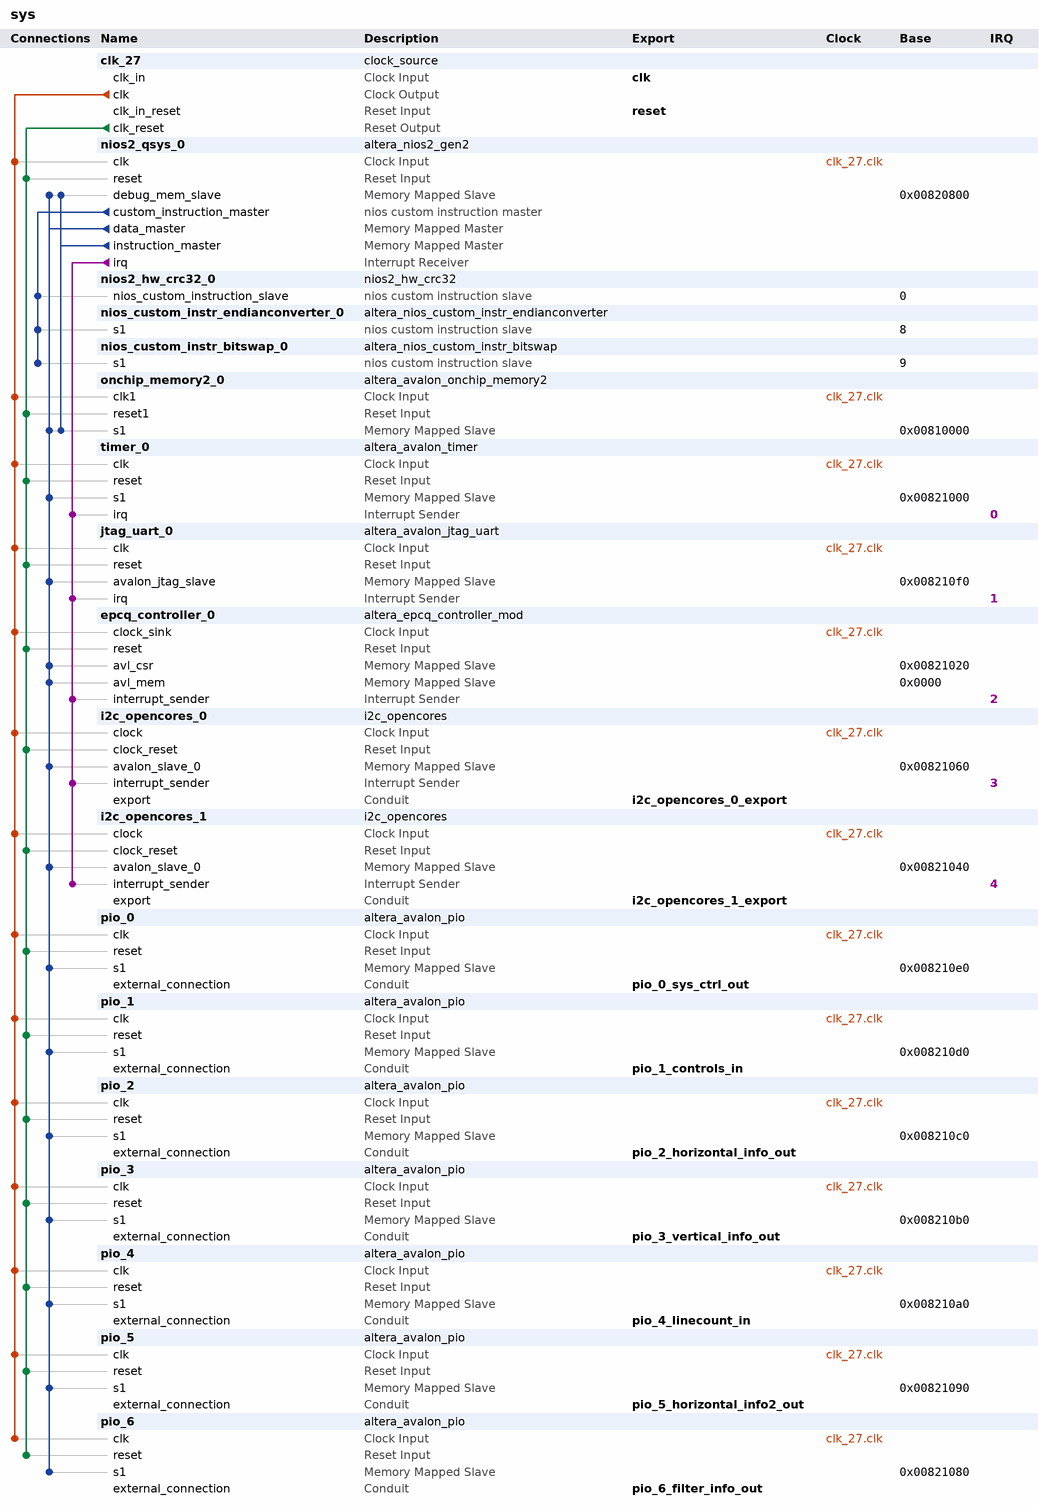
[diagram p0: system contents]
# Platform Designer (Qsys) system sys, Cyclone IV E EP4CE15E22C8
# Parameters at their usual value, and those the tool derives, are not listed.
package require -exact qsys 16.1
create_system sys
set_project_property DEVICE_FAMILY {Cyclone IV E}
set_project_property DEVICE EP4CE15E22C8

add_instance clk_27 clock_source 16.1
set_instance_parameter_value clk_27 clockFrequency 27000000

add_instance nios2_qsys_0 altera_nios2_gen2 16.1
set_instance_parameter_value nios2_qsys_0 dcache_size 0
set_instance_parameter_value nios2_qsys_0 exceptionSlave onchip_memory2_0.s1
set_instance_parameter_value nios2_qsys_0 icache_size 0
set_instance_parameter_value nios2_qsys_0 impl Tiny
set_instance_parameter_value nios2_qsys_0 resetSlave onchip_memory2_0.s1
set_instance_parameter_value nios2_qsys_0 setting_activateTrace true

add_instance nios2_hw_crc32_0 nios2_hw_crc32 16.1
set_instance_parameter_value nios2_hw_crc32_0 crc_width 32
set_instance_parameter_value nios2_hw_crc32_0 polynomial 79764919
set_instance_parameter_value nios2_hw_crc32_0 polynomial_inital 4294967295
set_instance_parameter_value nios2_hw_crc32_0 reflected_input 1
set_instance_parameter_value nios2_hw_crc32_0 reflected_output 1
set_instance_parameter_value nios2_hw_crc32_0 xor_output 4294967295

add_instance nios_custom_instr_endianconverter_0 altera_nios_custom_instr_endianconverter 16.1

add_instance nios_custom_instr_bitswap_0 altera_nios_custom_instr_bitswap 16.1

add_instance onchip_memory2_0 altera_avalon_onchip_memory2 16.1
set_instance_parameter_value onchip_memory2_0 dataWidth 32
set_instance_parameter_value onchip_memory2_0 dualPort false
set_instance_parameter_value onchip_memory2_0 initMemContent true
set_instance_parameter_value onchip_memory2_0 initializationFileName onchip_mem.hex
set_instance_parameter_value onchip_memory2_0 memorySize 40960

add_instance timer_0 altera_avalon_timer 16.1
set_instance_parameter_value timer_0 period 1
set_instance_parameter_value timer_0 periodUnits USEC

add_instance jtag_uart_0 altera_avalon_jtag_uart 16.1
set_instance_parameter_value jtag_uart_0 simInteractiveOptions NO_INTERACTIVE_WINDOWS
set_instance_parameter_value jtag_uart_0 useRegistersForReadBuffer true
set_instance_parameter_value jtag_uart_0 useRegistersForWriteBuffer true

add_instance epcq_controller_0 altera_epcq_controller_mod 16.1
set_instance_parameter_value epcq_controller_0 CHIP_SELS 1
set_instance_parameter_value epcq_controller_0 DDASI 0
set_instance_parameter_value epcq_controller_0 FLASH_TYPE EPCS64
set_instance_parameter_value epcq_controller_0 IO_MODE STANDARD
set_instance_parameter_value epcq_controller_0 clkFreq 27000000

add_instance i2c_opencores_0 i2c_opencores 16.1
set_instance_parameter_value i2c_opencores_0 dedicated_spi 0

add_instance i2c_opencores_1 i2c_opencores 16.1
set_instance_parameter_value i2c_opencores_1 dedicated_spi 1

add_instance pio_0 altera_avalon_pio 16.1
set_instance_parameter_value pio_0 direction Output
set_instance_parameter_value pio_0 width 8

add_instance pio_1 altera_avalon_pio 16.1
set_instance_parameter_value pio_1 direction Input
set_instance_parameter_value pio_1 width 32

add_instance pio_2 altera_avalon_pio 16.1
set_instance_parameter_value pio_2 direction Output
set_instance_parameter_value pio_2 width 32

add_instance pio_3 altera_avalon_pio 16.1
set_instance_parameter_value pio_3 direction Output
set_instance_parameter_value pio_3 width 32

add_instance pio_4 altera_avalon_pio 16.1
set_instance_parameter_value pio_4 direction Input
set_instance_parameter_value pio_4 width 32

add_instance pio_5 altera_avalon_pio 16.1
set_instance_parameter_value pio_5 direction Output
set_instance_parameter_value pio_5 width 32

add_instance pio_6 altera_avalon_pio 16.1
set_instance_parameter_value pio_6 direction Output
set_instance_parameter_value pio_6 width 32

# connections
add_connection clk_27.clk epcq_controller_0.clock_sink clock
add_connection clk_27.clk i2c_opencores_0.clock clock
add_connection clk_27.clk i2c_opencores_1.clock clock
add_connection clk_27.clk jtag_uart_0.clk clock
add_connection clk_27.clk nios2_qsys_0.clk clock
add_connection clk_27.clk onchip_memory2_0.clk1 clock
add_connection clk_27.clk pio_0.clk clock
add_connection clk_27.clk pio_1.clk clock
add_connection clk_27.clk pio_2.clk clock
add_connection clk_27.clk pio_3.clk clock
add_connection clk_27.clk pio_4.clk clock
add_connection clk_27.clk pio_5.clk clock
add_connection clk_27.clk pio_6.clk clock
add_connection clk_27.clk timer_0.clk clock
add_connection clk_27.clk_reset epcq_controller_0.reset reset
add_connection clk_27.clk_reset i2c_opencores_0.clock_reset reset
add_connection clk_27.clk_reset i2c_opencores_1.clock_reset reset
add_connection clk_27.clk_reset jtag_uart_0.reset reset
add_connection clk_27.clk_reset nios2_qsys_0.reset reset
add_connection clk_27.clk_reset onchip_memory2_0.reset1 reset
add_connection clk_27.clk_reset pio_0.reset reset
add_connection clk_27.clk_reset pio_1.reset reset
add_connection clk_27.clk_reset pio_2.reset reset
add_connection clk_27.clk_reset pio_3.reset reset
add_connection clk_27.clk_reset pio_4.reset reset
add_connection clk_27.clk_reset pio_5.reset reset
add_connection clk_27.clk_reset pio_6.reset reset
add_connection clk_27.clk_reset timer_0.reset reset
add_connection nios2_qsys_0.data_master epcq_controller_0.avl_csr avalon
set_connection_parameter_value nios2_qsys_0.data_master/epcq_controller_0.avl_csr baseAddress 0x00821020
add_connection nios2_qsys_0.data_master epcq_controller_0.avl_mem avalon
set_connection_parameter_value nios2_qsys_0.data_master/epcq_controller_0.avl_mem baseAddress 0x0000
add_connection nios2_qsys_0.data_master i2c_opencores_0.avalon_slave_0 avalon
set_connection_parameter_value nios2_qsys_0.data_master/i2c_opencores_0.avalon_slave_0 baseAddress 0x00821060
add_connection nios2_qsys_0.data_master i2c_opencores_1.avalon_slave_0 avalon
set_connection_parameter_value nios2_qsys_0.data_master/i2c_opencores_1.avalon_slave_0 baseAddress 0x00821040
add_connection nios2_qsys_0.data_master jtag_uart_0.avalon_jtag_slave avalon
set_connection_parameter_value nios2_qsys_0.data_master/jtag_uart_0.avalon_jtag_slave baseAddress 0x008210f0
add_connection nios2_qsys_0.data_master nios2_qsys_0.debug_mem_slave avalon
set_connection_parameter_value nios2_qsys_0.data_master/nios2_qsys_0.debug_mem_slave baseAddress 0x00820800
add_connection nios2_qsys_0.data_master onchip_memory2_0.s1 avalon
set_connection_parameter_value nios2_qsys_0.data_master/onchip_memory2_0.s1 baseAddress 0x00810000
add_connection nios2_qsys_0.data_master pio_0.s1 avalon
set_connection_parameter_value nios2_qsys_0.data_master/pio_0.s1 baseAddress 0x008210e0
add_connection nios2_qsys_0.data_master pio_1.s1 avalon
set_connection_parameter_value nios2_qsys_0.data_master/pio_1.s1 baseAddress 0x008210d0
add_connection nios2_qsys_0.data_master pio_2.s1 avalon
set_connection_parameter_value nios2_qsys_0.data_master/pio_2.s1 baseAddress 0x008210c0
add_connection nios2_qsys_0.data_master pio_3.s1 avalon
set_connection_parameter_value nios2_qsys_0.data_master/pio_3.s1 baseAddress 0x008210b0
add_connection nios2_qsys_0.data_master pio_4.s1 avalon
set_connection_parameter_value nios2_qsys_0.data_master/pio_4.s1 baseAddress 0x008210a0
add_connection nios2_qsys_0.data_master pio_5.s1 avalon
set_connection_parameter_value nios2_qsys_0.data_master/pio_5.s1 baseAddress 0x00821090
add_connection nios2_qsys_0.data_master pio_6.s1 avalon
set_connection_parameter_value nios2_qsys_0.data_master/pio_6.s1 baseAddress 0x00821080
add_connection nios2_qsys_0.data_master timer_0.s1 avalon
set_connection_parameter_value nios2_qsys_0.data_master/timer_0.s1 baseAddress 0x00821000
add_connection nios2_qsys_0.instruction_master nios2_qsys_0.debug_mem_slave avalon
set_connection_parameter_value nios2_qsys_0.instruction_master/nios2_qsys_0.debug_mem_slave baseAddress 0x00820800
add_connection nios2_qsys_0.instruction_master onchip_memory2_0.s1 avalon
set_connection_parameter_value nios2_qsys_0.instruction_master/onchip_memory2_0.s1 baseAddress 0x00810000
add_connection nios2_qsys_0.irq epcq_controller_0.interrupt_sender interrupt
set_connection_parameter_value nios2_qsys_0.irq/epcq_controller_0.interrupt_sender irqNumber 2
add_connection nios2_qsys_0.irq i2c_opencores_0.interrupt_sender interrupt
set_connection_parameter_value nios2_qsys_0.irq/i2c_opencores_0.interrupt_sender irqNumber 3
add_connection nios2_qsys_0.irq i2c_opencores_1.interrupt_sender interrupt
set_connection_parameter_value nios2_qsys_0.irq/i2c_opencores_1.interrupt_sender irqNumber 4
add_connection nios2_qsys_0.irq jtag_uart_0.irq interrupt
set_connection_parameter_value nios2_qsys_0.irq/jtag_uart_0.irq irqNumber 1
add_connection nios2_qsys_0.irq timer_0.irq interrupt
set_connection_parameter_value nios2_qsys_0.irq/timer_0.irq irqNumber 0
add_connection nios2_qsys_0.custom_instruction_master nios2_hw_crc32_0.nios_custom_instruction_slave nios_custom_instruction
set_connection_parameter_value nios2_qsys_0.custom_instruction_master/nios2_hw_crc32_0.nios_custom_instruction_slave CIName nios2_hw_crc32_0
set_connection_parameter_value nios2_qsys_0.custom_instruction_master/nios2_hw_crc32_0.nios_custom_instruction_slave baseAddress 0
add_connection nios2_qsys_0.custom_instruction_master nios_custom_instr_bitswap_0.s1 nios_custom_instruction
set_connection_parameter_value nios2_qsys_0.custom_instruction_master/nios_custom_instr_bitswap_0.s1 CIName nios_custom_instr_bitswap_0
set_connection_parameter_value nios2_qsys_0.custom_instruction_master/nios_custom_instr_bitswap_0.s1 baseAddress 9
add_connection nios2_qsys_0.custom_instruction_master nios_custom_instr_endianconverter_0.s1 nios_custom_instruction
set_connection_parameter_value nios2_qsys_0.custom_instruction_master/nios_custom_instr_endianconverter_0.s1 CIName nios_custom_instr_endianconverter_0
set_connection_parameter_value nios2_qsys_0.custom_instruction_master/nios_custom_instr_endianconverter_0.s1 baseAddress 8

# exported interfaces
add_interface clk clock sink
set_interface_property clk EXPORT_OF clk_27.clk_in
add_interface i2c_opencores_0_export conduit end
set_interface_property i2c_opencores_0_export EXPORT_OF i2c_opencores_0.export
add_interface i2c_opencores_1_export conduit end
set_interface_property i2c_opencores_1_export EXPORT_OF i2c_opencores_1.export
add_interface pio_0_sys_ctrl_out conduit end
set_interface_property pio_0_sys_ctrl_out EXPORT_OF pio_0.external_connection
add_interface pio_1_controls_in conduit end
set_interface_property pio_1_controls_in EXPORT_OF pio_1.external_connection
add_interface pio_2_horizontal_info_out conduit end
set_interface_property pio_2_horizontal_info_out EXPORT_OF pio_2.external_connection
add_interface pio_3_vertical_info_out conduit end
set_interface_property pio_3_vertical_info_out EXPORT_OF pio_3.external_connection
add_interface pio_4_linecount_in conduit end
set_interface_property pio_4_linecount_in EXPORT_OF pio_4.external_connection
add_interface pio_5_horizontal_info2_out conduit end
set_interface_property pio_5_horizontal_info2_out EXPORT_OF pio_5.external_connection
add_interface pio_6_filter_info_out conduit end
set_interface_property pio_6_filter_info_out EXPORT_OF pio_6.external_connection
add_interface reset reset sink
set_interface_property reset EXPORT_OF clk_27.clk_in_reset

set_interconnect_requirement {$system} qsys_mm.clockCrossingAdapter HANDSHAKE
set_interconnect_requirement {$system} qsys_mm.insertDefaultSlave false
set_interconnect_requirement {$system} qsys_mm.maxAdditionalLatency 1

save_system sys.qsys
